# Altium project SensorNode.PrjPcb
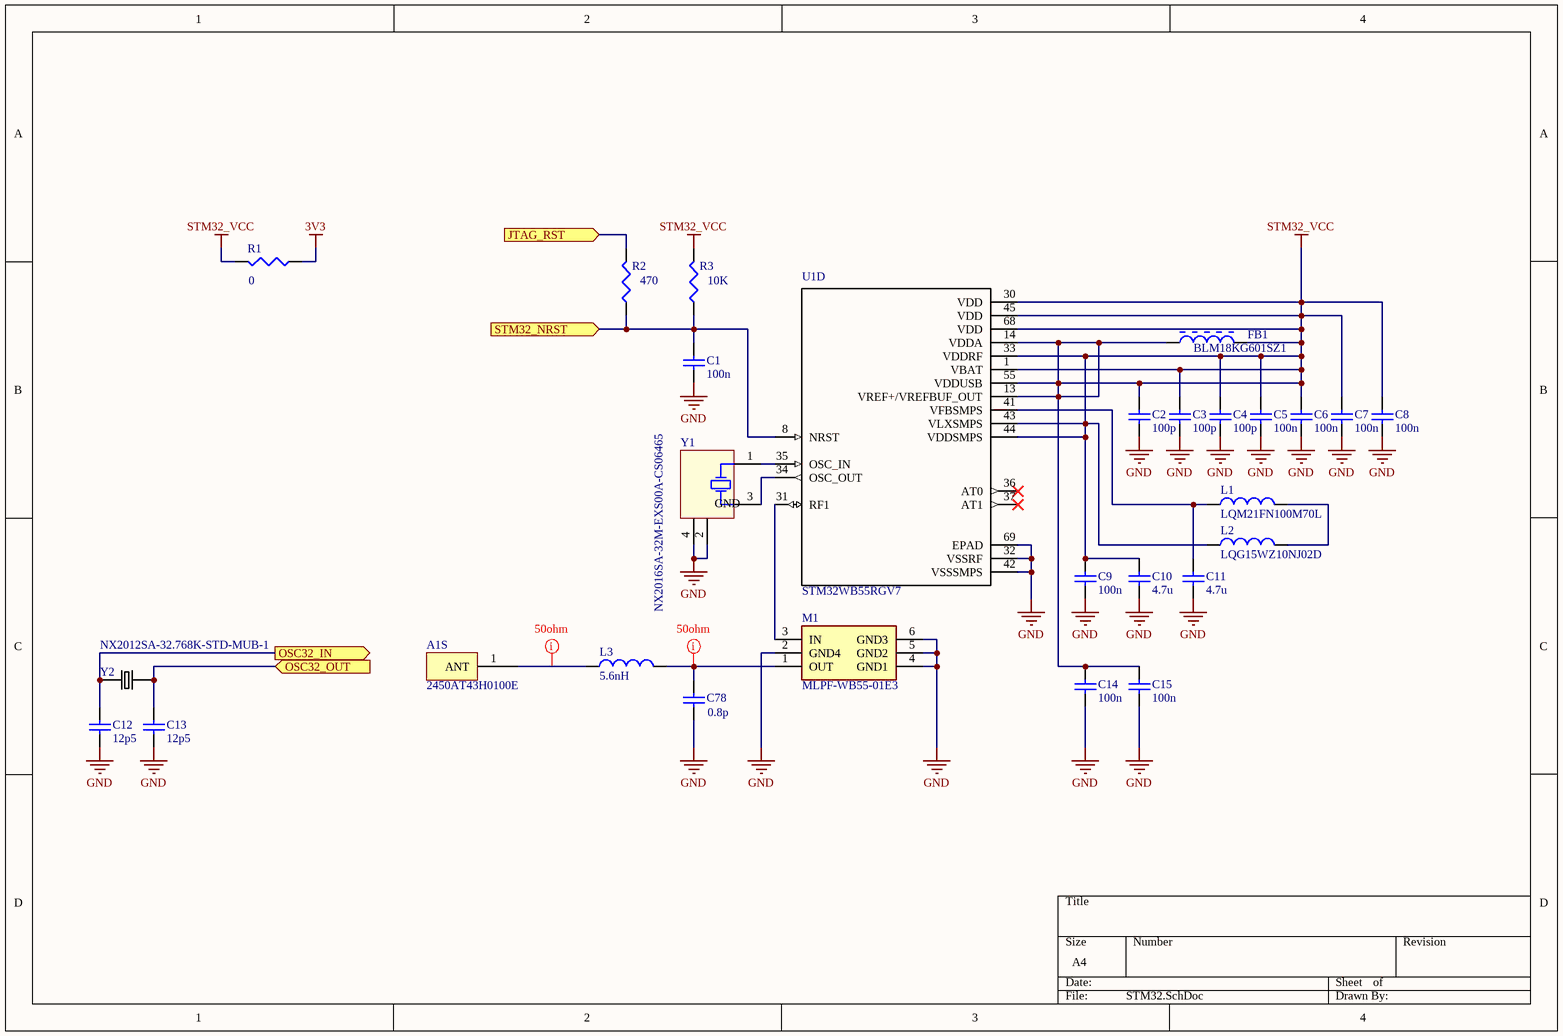
[diagram p0: STM32.SchDoc]
7 sheets, 166 parts. Net scope: flat (ports and power ports of the same name join across sheets).
Board file: PCB1.PcbDoc
Sheets:
  STM32.SchDoc
  STM32_GPIO.SchDoc
  ExtFlash.SchDoc
  TmpLightHumBaro.SchDoc
  MotionMicrophone.SchDoc
  DW1000.SchDoc
  PowerDomains.SchDoc

## Sheet STM32.SchDoc
size A4

### Parts
A1S  2450AT43H0100E  [2450AT43H0100E]
C1  100n  [CAPC1608X90X35NL10T15]
C2  100p  [CAPC1608X90X35NL10T15]
C3  100p  [CAPC1608X90X35NL10T15]
C4  100p  [CAPC1608X90X35NL10T15]
C5  100n  [CAPC1608X90X35NL10T15]
C6  100n  [CAPC1608X90X35NL10T15]
C7  100n  [CAPC1608X90X35NL10T15]
C8  100n  [CAPC1608X90X35NL10T15]
C9  100n  [CAPC1608X90X35NL10T15]
C10  4.7u  [CAPC1608X90X35NL10T15]
C11  4.7u  [CAPC1608X90X35NL10T15]
C12  12p5  [CAPC1608X90X35NL10T15]
C13  12p5  [CAPC1608X90X35NL10T15]
C14  100n  [CAPC1608X90X35NL10T15]
C15  100n  [CAPC1608X90X35NL10T15]
C78  0.8p  [CAPC1005X55X25ML05T10]
FB1  BLM18KG601SZ1  [MURA-BLM18SG-B25-CHIP-2_V1]
L1  LQM21FN100M70L  [MURA-IND0805_L]
L2  LQG15WZ10NJ02D  [0402-A]
L3  5.6nH  [0402-A]
M1  MLPF-WB55-01E3  [MLPFWB5501E3]
R1  value 0  [J1-0603]
R2  value 470  [J1-0603]
R3  value 10K  [J1-0603]
U1  STM32WB55RGV7  [*QFN40P800X800X100-69N]  (part D of 4)
Y1  NX2016SA-32M-EXS00A-CS06465  [NDK-NX2016SA-26MHZ-EXS00A-CS06025-4_V]
Y2  NX2012SA-32.768K-STD-MUB-1  [*XTAL_NX2012SA-32.768K-STD-MUB-1]

### Ports
JTAG_RST (in), OSC32_IN (out), OSC32_OUT (in), STM32_NRST (in)

### Nets
3V3: R1.1
GND: C1.1 C2.1 C3.1 C4.1 C5.1 C6.1 C7.1 C8.1 C9.1 C10.1 C11.1 C12.1 C13.1 C14.1 C15.1 C78.1 M1.2(GND4) M1.4(GND1) M1.5(GND2) M1.6(GND3) U1.32(VSSRF) U1.42(VSSSMPS) U1.69(EPAD) Y1.2(GND) Y1.4(GND)
STM32_VCC: C2.2 C3.2 C4.2 C5.2 C6.2 C7.2 C8.2 C9.2 C10.2 C14.2 C15.2 FB1.1 FB1.2 L2.1 R1.2 R3.2 U1.1(VBAT) U1.13(VREF+/VREFBUF_OUT) U1.14(VDDA) U1.30(VDD) U1.33(VDDRF) U1.43(VLXSMPS) U1.44(VDDSMPS) U1.45(VDD) U1.55(VDDUSB) U1.68(VDD)
NetA1S_1: A1S.1(ANT) L3.1
NetC1_2: C1.2 R2.1 R3.1 U1.8(NRST) ; port STM32_NRST
NetC11_2: C11.2 L1.1 U1.41(VFBSMPS)
NetC12_2: C12.2 Y2.1 ; port OSC32_IN
NetC13_2: C13.2 Y2.2 ; port OSC32_OUT
NetC78_2: C78.2 L3.2 M1.1(OUT)
NetJ2_10: R2.2 ; port JTAG_RST
NetL1_2: L1.2 L2.2
NetM1_3: M1.3(IN) U1.31(RF1)
NetU1_34: U1.34(OSC_OUT) Y1.3(X2)
NetU1_35: U1.35(OSC_IN) Y1.1(X1)

Not connected (* = marked no-connect by the designer): U1 36(AT0)* 37(AT1)*

### Layout directives
rule Width Constraint [Pref Impedance = 50,00ohms    Min Impedance = 50,00ohms    Max Impedance = 50,00ohms]; rule Routing Layers [TopLayer - Enabled BottomLayer - Disabled]; rule Parallel Segment Constraint [Gap = 0.5mm    Limit = 10mm    Layer - Same Layer]: NetA1S_1, NetC78_2

### Library data of the parts
C1 C15 = CMP-2006-02891-1: Part Number: GRM188R71H102KA01D; Manufacturer: Murata
C2-C14 = CMP-2006-02891-1
C78 = CMP-2008-03945-1
FB1 = CMP-0686-00596-2: Chip Ferrite Bead for Power Lines (Low DC Resistance Type), 220 Ohm, 2500 mA, -55 to 125 degC, 1.6 x 0.8 x 0.65 mm SMD, Tape and Reel; Manufacturer: Murata; PartNumber: BLM18SG221TN1D; Impedance (at 100 MHz): 220 Ohm +/- 25%; DC Resistance: 0.040 Ohm Max.; Rated Current: 2500 mA; ComponentLink2Description: Datasheet; ComponentLink1Description: Manufacturer URL; ComponentLink3Description: Package Specification; DatasheetVersion: 08/2013; Packing: Tape and Reel; PackageReference: BLM18_H650-2; PackageDescription: 2-Pin Chip, Body 1.6 x 0.8 mm; Mounting Technology: Surface Mount; Operating Temperature Range: -55 to 125 degC; ComponentLink1URL: http://www.murata.com/; ComponentLink2URL: http://www.murata.com/products/catalog/pdf/c31e.pdf; ComponentLink3URL: http://www.murata.com/products/catalog/pdf/c31e.pdf
L1 = CMP-2000-06587-1: Fixed Inductor, 10 uH, +/-20%, -55 to 125 degC, 2-Pin SMD (0805), RoHS, Tape and Reel; Manufacturer: Murata; Tolerance (%): 20%; DC Resistance: 0.6; Inductance-Nom: 10H; Rated Current-Max: 100mA; Package Reference: IND0805; Case Size/Dimension: 0805; Manufacturer URL: http://www.murata.com/; Package Description: 2-Pin Surface Mount Device, Body 2 x 1.25 mm; Datasheet URL: http://psearch.en.murata.com/inductor/product/LQM21FN100M70%23.pdf; Mounting Technology: SurfaceMount; Datasheet Version: 05/2016
L2 L3 = Inductor: Code_IEC: 1005; Published: 8-Jun-2000; LatestRevisionDate: 29-May-2009; LatestRevisionNote: IPC-7351 Footprint Added.; PackageReference: 0402-A; Publisher: Altium Limited; PackageDescription: Chip Inductor; Code_JEITA: 0402
M1 = MLPF-WB55-01E3: Filter; Manufacturer_Name: STMicroelectronics; Datasheet Link: https://componentsearchengine.com/Datasheets/1/MLPF-WB55-01E3.pdf; Height: 0.7mm; Mouser Part Number: 511-MLPF-WB55-01E3; Mouser Price/Stock: https://www.mouser.com/Search/Refine.aspx?Keyword=511-MLPF-WB55-01E3; Manufacturer_Part_Number: MLPF-WB55-01E3
R1-R3 = Res3: Resistor; Published: 8-Jun-2000; LatestRevisionDate: 29-May-2009; LatestRevisionNote: IPC-7351 Footprint Added.; PackageReference: J1-0603; Publisher: Altium Limited; PackageDescription: Chip Resistor
U1 = STM32WB55RGV7: Multiprotocol wireless 32-bit MCU Arm-based Cortex-M4; MF: STMicroelectronics; MP: STM32WB55RGV7; Price: None; Package: None; Availability: Unavailable; SnapEDA_Link: https://www.snapeda.com/parts/STM32WB55RGV7/STMicroelectronics/view-part/?ref=snap; Value: *
Y1 = CMP-0454-00001-2: Crystal, 26 MHz, 8 pF, for OA / AV / Short-range Wireless, -10 to 75 degC, 2.0 x 1.6 x 0.45 mm SMD; PartNumber: NX2016SA-26MHZ-EXS00A-CS06025; Manufacturer: NDK; Level of drive: 10 uW (Max. 200 uW); Overtone Order: Fundamental; Load Capacitance: 8 pF; Nominal Frequency: 26 MHz; Operating Temperature: -10 to 75 degC; ComponentLink1Description: Manufacturer URL; ComponentLink3Description: Package Specification; ComponentLink3URL: http://www.ndk.com/images/products/catalog/c_NX2016SA-STD-CZS-1_e.pdf; PackageDescription: 4-Pin Hand Drawn, Body 2x1.6mm; Storage temperature range: -40 to 85 degC; ComponentLink1URL: https://www.ndk.com; Mounting Technology: Surface Mount; PackageReference: NX2016SA-26MHZ-EXS00A-CS06025-4; ComponentLink2Description: Datasheet; ComponentLink2URL: http://www.ndk.com/images/products/catalog/c_NX2016SA-STD-CZS-1_e.pdf
Y2 = NX2012SA-32.768K-STD-MUB-1: Crystal 32.7680khz 12.5pf Smd; MF: NDK America,; MP: NX2012SA-32.768K-STD-MUB-1; Price: None; Package: SMD-2 NDK; Availability: Unavailable; SnapEDA_Link: https://www.snapeda.com/parts/NX2012SA-32.768K-STD-MUB-1/NDK%20America%2C%20Inc./view-part/?ref=snap; Value: *

## Sheet STM32_GPIO.SchDoc
size A4
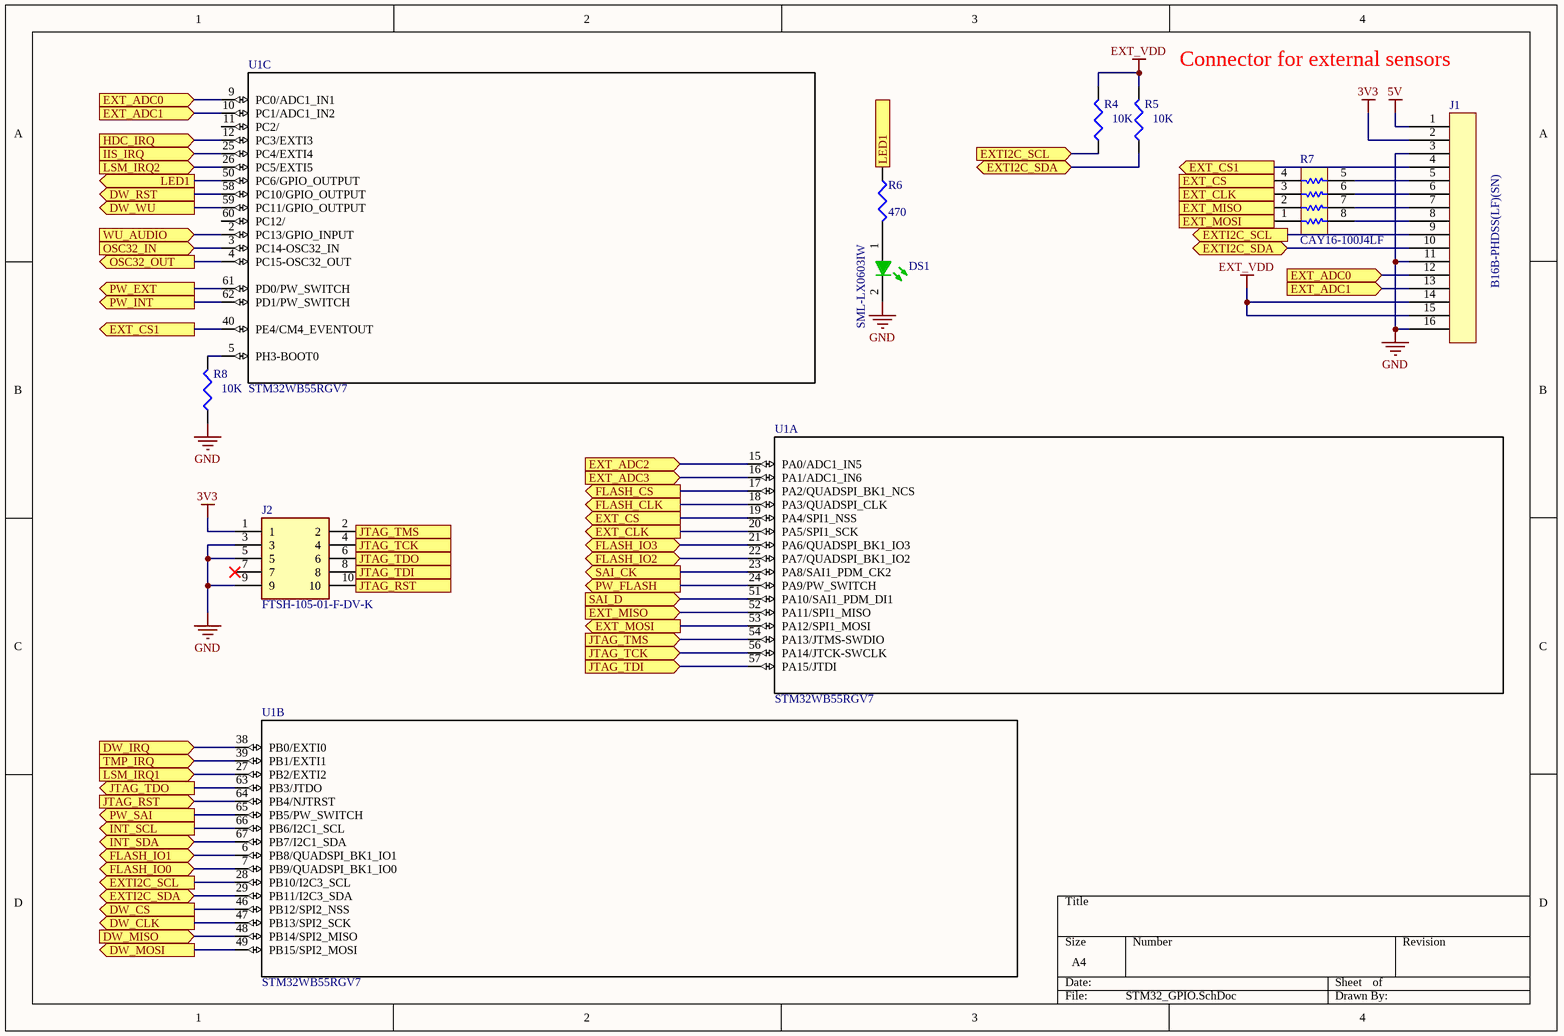
[diagram p1: STM32_GPIO.SchDoc]

### Parts
DS1  SML-LX0603IW  [KING-0603LED_GREEN_V]
J1  B16B-PHDSS(LF)(SN)  [B16B-PHDSS(LF)(SN) - duplicate]
J2  FTSH-105-01-F-DV-K  [SAMTEC_FTSH-105-01-L-DV]
R4  value 10K  [J1-0603]
R5  value 10K  [J1-0603]
R6  value 470  [J1-0603]
R7  CAY16-100J4LF  [BOUR-CAY16-J4_V]
R8  value 10K  [J1-0603]
U1  STM32WB55RGV7  [*QFN40P800X800X100-69N]  (parts A,B,C of 4)

### Ports
DW_CLK (out), DW_CS (out), DW_IRQ (in), DW_MISO (in), DW_MOSI (out), DW_RST (out), DW_WU (out), EXT_ADC0 (in), EXT_ADC1 (in), EXT_ADC2 (in), EXT_ADC3 (in), EXT_CLK (out), EXT_CS1 (out), EXT_CS (out), EXT_MISO (in), EXT_MOSI (out), EXTI2C_SCL (in), EXTI2C_SCL (out), EXTI2C_SDA (bidir), FLASH_CLK (out), FLASH_CS (out), FLASH_IO0 (bidir), FLASH_IO1 (bidir), FLASH_IO2 (bidir), FLASH_IO3 (bidir), HDC_IRQ (in), IIS_IRQ (in), INT_SCL (out), INT_SDA (bidir), JTAG_RST (in), JTAG_RST (out), JTAG_TCK (in), JTAG_TCK (out), JTAG_TDI (in), JTAG_TDI (out), JTAG_TDO (in), JTAG_TDO (out), JTAG_TMS (in), JTAG_TMS (out), LED1 (in), LED1 (out), LSM_IRQ1 (in), LSM_IRQ2 (in), OSC32_IN (in), OSC32_OUT (out), PW_EXT (out), PW_FLASH (out), PW_INT (out), PW_SAI (out), SAI_CK (out), SAI_D (in), TMP_IRQ (in), WU_AUDIO (in)

### Nets
3V3: J1.2 J2.1
5V: J1.1
EXT_VDD: J1.14 J1.15 R4.2 R5.2
GND: DS1.2(K) J1.3 J1.11 J1.16 J2.3 J2.5 J2.9 R8.1
NetC12_2: U1.3(PC14-OSC32_IN) ; port OSC32_IN
NetC13_2: U1.4(PC15-OSC32_OUT) ; port OSC32_OUT
NetDS1_1: DS1.1(A) R6.2
NetJ1_4: J1.4 U1.40(PE4/CM4_EVENTOUT) ; port EXT_CS1
NetJ1_5: J1.5 R7.5
NetJ1_6: J1.6 R7.6
NetJ1_7: J1.7 R7.7
NetJ1_8: J1.8 R7.8
NetJ1_9: J1.9 R4.1 U1.28(PB10/I2C3_SCL) ; port EXTI2C_SCL
NetJ1_10: J1.10 R5.1 U1.29(PB11/I2C3_SDA) ; port EXTI2C_SDA
NetJ1_12: J1.12 U1.9(PC0/ADC1_IN1) ; port EXT_ADC0
NetJ1_13: J1.13 U1.10(PC1/ADC1_IN2) ; port EXT_ADC1
NetJ2_2: J2.2 U1.54(PA13/JTMS-SWDIO) ; port JTAG_TMS
NetJ2_4: J2.4 U1.56(PA14/JTCK-SWCLK) ; port JTAG_TCK
NetJ2_6: J2.6 U1.63(PB3/JTDO) ; port JTAG_TDO
NetJ2_8: J2.8 U1.57(PA15/JTDI) ; port JTAG_TDI
NetJ2_10: J2.10 U1.64(PB4/NJTRST) ; port JTAG_RST
NetJ3_12: U1.15(PA0/ADC1_IN5) ; port EXT_ADC2
NetJ3_13: U1.16(PA1/ADC1_IN6) ; port EXT_ADC3
NetR6_1: R6.1 U1.50(PC6/GPIO_OUTPUT) ; port LED1
NetR7_1: R7.1 U1.53(PA12/SPI1_MOSI) ; port EXT_MOSI
NetR7_2: R7.2 U1.52(PA11/SPI1_MISO) ; port EXT_MISO
NetR7_3: R7.3 U1.20(PA5/SPI1_SCK) ; port EXT_CLK
NetR7_4: R7.4 U1.19(PA4/SPI1_NSS) ; port EXT_CS
NetR8_2: R8.2 U1.5(PH3-BOOT0)
NetR11_5: U1.46(PB12/SPI2_NSS) ; port DW_CS
NetR11_6: U1.49(PB15/SPI2_MOSI) ; port DW_MOSI
NetR11_7: U1.48(PB14/SPI2_MISO) ; port DW_MISO
NetR11_8: U1.47(PB13/SPI2_SCK) ; port DW_CLK
NetR16_2: U1.38(PB0/EXTI0) ; port DW_IRQ
NetR30_1: U1.17(PA2/QUADSPI_BK1_NCS) ; port FLASH_CS
NetR30_2: U1.6(PB8/QUADSPI_BK1_IO1) ; port FLASH_IO1
NetR30_3: U1.22(PA7/QUADSPI_BK1_IO2) ; port FLASH_IO2
NetR31_5: U1.7(PB9/QUADSPI_BK1_IO0) ; port FLASH_IO0
NetR31_6: U1.18(PA3/QUADSPI_CLK) ; port FLASH_CLK
NetR31_7: U1.21(PA6/QUADSPI_BK1_IO3) ; port FLASH_IO3
NetR38_2: U1.2(PC13/GPIO_INPUT) ; port WU_AUDIO
NetR42_1: U1.39(PB1/EXTI1) ; port TMP_IRQ
NetR43_2: U1.12(PC3/EXTI3) ; port HDC_IRQ
NetR44_2: U1.25(PC4/EXTI4) ; port IIS_IRQ
NetR45_2: U1.26(PC5/EXTI5) ; port LSM_IRQ2
NetR46_1: U1.67(PB7/I2C1_SDA) ; port INT_SDA
NetR47_1: U1.66(PB6/I2C1_SCL) ; port INT_SCL
NetR48_2: U1.27(PB2/EXTI2) ; port LSM_IRQ1
NetS2_2: U1.51(PA10/SAI1_PDM_DI1) ; port SAI_D
NetS2_3: U1.23(PA8/SAI1_PDM_CK2) ; port SAI_CK
NetU1_24: U1.24(PA9/PW_SWITCH) ; port PW_FLASH
NetU1_58: U1.58(PC10/GPIO_OUTPUT) ; port DW_RST
NetU1_59: U1.59(PC11/GPIO_OUTPUT) ; port DW_WU
NetU1_61: U1.61(PD0/PW_SWITCH) ; port PW_EXT
NetU1_62: U1.62(PD1/PW_SWITCH) ; port PW_INT
NetU1_65: U1.65(PB5/PW_SWITCH) ; port PW_SAI

Not connected (* = marked no-connect by the designer): J2 7*; U1 11(PC2/) 60(PC12/)

### Notes on the sheet
- Connector for external sensors

### Library data of the parts
DS1 = CMP-0404-00001-1: LED, SMT, 0603(1608), 1.1mm thickness, Green; Manufacturer: Kingbright; PartNumber: KP-1608MGC; Reverse Voltage: 5 V; Power Dissipation: 75 mW; Forward Current: 30 mA; Packing Type: 2000 pcs / reel; Mounting Technology: Surface Mount; Storage Temperature: -40 to +85 degC; ComponentLink1URL: http://www.kingbright.com/; PackageDescription: 2-Pin SMT LED, 1.6 x 0.8 mm Pitch; PackageReference: 0603LED_GREEN; ComponentLink1Description: Manufacturer URL
J1 = B16B-PHDSS(LF)(SN): CONN HEADER VERT 16POS 2MM; ComponentLink1Description: Digikey; ComponentLink1URL: https://www.digikey.com/products/en?keywords=B16B-PHDSS(LF)(SN)
J2 = FTSH-105-01-F-DV-K: Connector; Manufacturer_Name: SAMTEC; Datasheet Link: http://suddendocs.samtec.com/prints/ftsh-1xx-xx-xxx-dv-xxx-xxx-mkt.pdf; Manufacturer_Part_Number: FTSH-105-01-F-DV-K; Mouser Part Number: 200-FTSH10501FDVK; Mouser Price/Stock: https://www.mouser.com/Search/Refine.aspx?Keyword=200-FTSH10501FDVK; RS Part Number: 1592372; RS Price/Stock: http://uk.rs-online.com/web/p/products/1592372
R4-R6 R8 = Res3: Resistor; Published: 8-Jun-2000; LatestRevisionDate: 29-May-2009; LatestRevisionNote: IPC-7351 Footprint Added.; PackageReference: J1-0603; Publisher: Altium Limited; PackageDescription: Chip Resistor
R7 = CMP-1747-00007-1: Chip Resistor Array, 1 KOhm, +/- 5%, 62.5 mW, -55 to 125 degC, 8-Pin SMD, RoHS, Tape and Reel; Power Rating: 100 mW; Tolerance: 1%; Voltage Rating (DC): 50 V; Resistance: 330 Ohm; Case\Package: 0603; RoHSCompliant: true; Case Code (Metric): 1608; Pins: 2; PackageDescription: 8-Pin Surface Mount Device, Body 1.6 x 3.2 mm, Pitch 0.8 mm; Height: 0.45 mm; Min Operating Temperature: -55 degC; ComponentLink1URL: http://www.bourns.com/; Case Code (Imperial): 0603; Packaging: Tape and Reel; PackageReference: CAY16-J4; ComponentLink1Description: Manufacturer URL; ComponentLink2Description: Datasheet; Length: 1.6 mm; Width: 0.8 mm; Max Operating Temperature: 155 degC; Mount: Surface Mount; DatasheetVersion: Sep-14; Voltage Rating: 50 V; REACH SVHC: No SVHC; ComponentLink2URL: http://www.bourns.com/pdfs/CATCAY.pdf; Package Quantity: 5000
U1 = STM32WB55RGV7: as U1 on sheet STM32; MP: STM32WB55RGV7; Price: None; Package: None; Availability: Unavailable; SnapEDA_Link: https://www.snapeda.com/parts/STM32WB55RGV7/STMicroelectronics/view-part/?ref=snap; Value: *

## Sheet ExtFlash.SchDoc
size A4
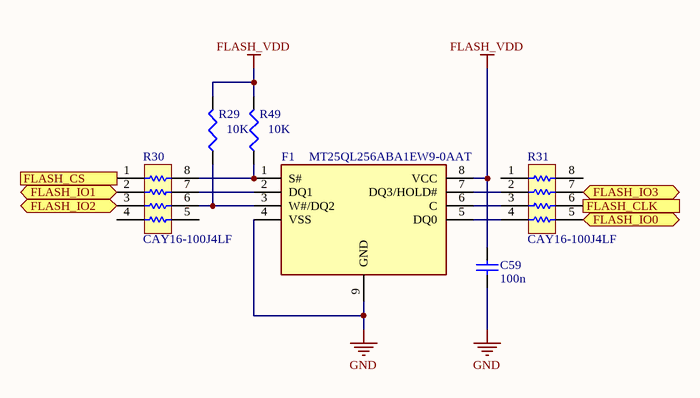
[diagram p2: ExtFlash.SchDoc]

### Parts
C59  100n  [CAPC1608X90X35NL10T15]
F1  MT25QL256ABA1EW9-0AAT  [SON127P800X600X80-9N-D]
R29  value 10K  [J1-0603]
R30  CAY16-100J4LF  [BOUR-CAY16-J4_V]
R31  CAY16-100J4LF  [BOUR-CAY16-J4_V]
R49  value 10K  [J1-0603]

### Ports
FLASH_CLK (in), FLASH_CS (in), FLASH_IO0 (bidir), FLASH_IO1 (bidir), FLASH_IO2 (bidir), FLASH_IO3 (bidir)

### Nets
FLASH_VDD: C59.2 F1.8(VCC) R29.2 R49.2
GND: C59.1 F1.4(VSS) F1.9(GND)
NetF1_1: F1.1(S#) R30.8 R49.1
NetF1_2: F1.2(DQ1) R30.7
NetF1_3: F1.3(W#/DQ2) R29.1 R30.6
NetF1_5: F1.5(DQ0) R31.4
NetF1_6: F1.6(C) R31.3
NetF1_7: F1.7(DQ3/HOLD#) R31.2
NetR30_1: R30.1 ; port FLASH_CS
NetR30_2: R30.2 ; port FLASH_IO1
NetR30_3: R30.3 ; port FLASH_IO2
NetR31_5: R31.5 ; port FLASH_IO0
NetR31_6: R31.6 ; port FLASH_CLK
NetR31_7: R31.7 ; port FLASH_IO3

Not connected (* = marked no-connect by the designer): R30 4 5; R31 1 8

### Library data of the parts
C59 = CMP-2006-02891-1: as C1 on sheet STM32
F1 = MT25QL256ABA1EW9-0AAT: Integrated Circuit; Manufacturer_Name: Micron; Datasheet Link: https://www.micron.com/~/media/documents/products/data-sheet/nor-flash/serial-nor/mt25q/die-rev-a/mt25q_qljs_l_256_aba_0.pdf; Height: 0.8mm; Manufacturer_Part_Number: MT25QL256ABA1EW9-0AAT; Mouser Part Number: 340-322381-TRAY; Mouser Price/Stock: https://www.mouser.com/Search/Refine.aspx?Keyword=340-322381-TRAY
R29 R49 = Res3: Resistor; Published: 8-Jun-2000; LatestRevisionDate: 29-May-2009; LatestRevisionNote: IPC-7351 Footprint Added.; PackageReference: J1-0603; Publisher: Altium Limited; PackageDescription: Chip Resistor
R30 R31 = CMP-1747-00007-1: as R7 on sheet STM32_GPIO; RoHSCompliant: true; Case Code (Metric): 1608; Pins: 2; PackageDescription: 8-Pin Surface Mount Device, Body 1.6 x 3.2 mm, Pitch 0.8 mm; Height: 0.45 mm; Min Operating Temperature: -55 degC; ComponentLink1URL: http://www.bourns.com/; Case Code (Imperial): 0603; Packaging: Tape and Reel; PackageReference: CAY16-J4; ComponentLink1Description: Manufacturer URL; ComponentLink2Description: Datasheet; Length: 1.6 mm; Width: 0.8 mm; Max Operating Temperature: 155 degC; Mount: Surface Mount; DatasheetVersion: Sep-14; Voltage Rating: 50 V; REACH SVHC: No SVHC; ComponentLink2URL: http://www.bourns.com/pdfs/CATCAY.pdf; Package Quantity: 5000

## Sheet TmpLightHumBaro.SchDoc
size A4
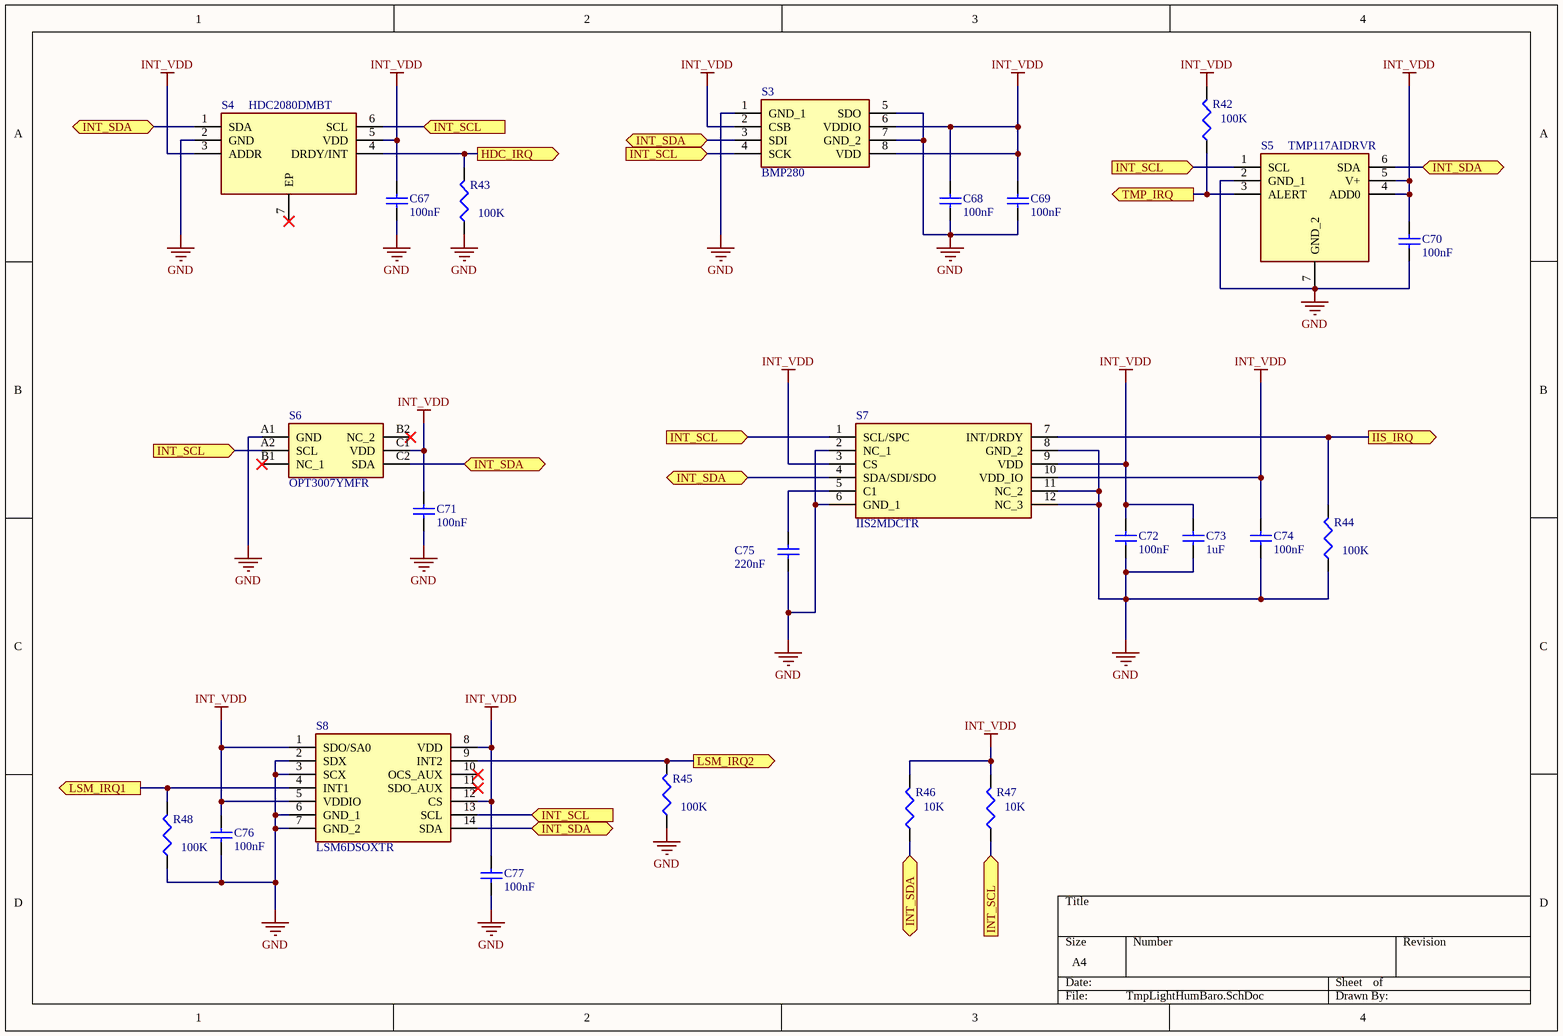
[diagram p3: TmpLightHumBaro.SchDoc]

### Parts
C67  100nF  [CAPC1608X90X35NL10T15]
C68  100nF  [CAPC1608X90X35NL10T15]
C69  100nF  [CAPC1608X90X35NL10T15]
C70  100nF  [CAPC1608X90X35NL10T15]
C71  100nF  [CAPC1608X90X35NL10T15]
C72  100nF  [CAPC1608X90X35NL10T15]
C73  1uF  [CAPC1608X90X35NL10T15]
C74  100nF  [CAPC1608X90X35NL10T15]
C75  220nF  [CAPC1608X90X35NL10T15]
C76  100nF  [CAPC1608X90X35NL10T15]
C77  100nF  [CAPC1608X90X35NL10T15]
R42  value 100K  [J1-0603]
R43  value 100K  [J1-0603]
R44  value 100K  [J1-0603]
R45  value 100K  [J1-0603]
R46  value 10K  [J1-0603]
R47  value 10K  [J1-0603]
R48  value 100K  [J1-0603]
S3  BMP280  [8-PIN-METAL-LID-LGA_1]
S4  HDC2080DMBT  [SON100P300X300X80-7N-D]
S5  TMP117AIDRVR  [SON65P200X200X80-7N]
S6  OPT3007YMFR  [BGA6C35P2X3_86X95X23]
S7  IIS2MDCTR  [IIS2MDCTR]
S8  LSM6DSOXTR  [LGA-14_1]

### Ports
HDC_IRQ (out), IIS_IRQ (out), INT_SCL (in), INT_SDA (bidir), LSM_IRQ1 (out), LSM_IRQ2 (out), TMP_IRQ (out)

### Nets
GND: C67.2 C68.2 C69.2 C70.2 C71.2 C72.2 C73.2 C74.2 C75.2 C76.2 C77.2 R43.1 R44.1 R45.1 R48.1 S3.1(GND_1) S3.5(SDO) S3.7(GND_2) S4.2(GND) S5.2(GND_1) S5.7(GND_2) S6.A1(GND) S7.2(NC_1) S7.6(GND_1) S7.8(GND_2) S7.11(NC_2) S7.12(NC_3) S8.2(SDX) S8.3(SCX) S8.6(GND_1) S8.7(GND_2)
INT_VDD: C67.1 C68.1 C69.1 C70.1 C71.1 C72.1 C73.1 C74.1 C76.1 C77.1 R42.2 R46.2 R47.2 S3.2(CSB) S3.6(VDDIO) S3.8(VDD) S4.3(ADDR) S4.5(VDD) S5.4(ADD0) S5.5(V+) S6.C1(VDD) S7.3(CS) S7.9(VDD) S7.10(VDD_IO) S8.1(SDO/SA0) S8.5(VDDIO) S8.8(VDD) S8.12(CS)
NetC75_1: C75.1 S7.5(C1)
NetR42_1: R42.1 S5.3(ALERT) ; port TMP_IRQ
NetR43_2: R43.2 S4.4(DRDY/INT) ; port HDC_IRQ
NetR44_2: R44.2 S7.7(INT/DRDY) ; port IIS_IRQ
NetR45_2: R45.2 S8.9(INT2) ; port LSM_IRQ2
NetR46_1: R46.1 S3.3(SDI) S4.1(SDA) S5.6(SDA) S6.C2(SDA) S7.4(SDA/SDI/SDO) S8.14(SDA) ; port INT_SDA
NetR47_1: R47.1 S3.4(SCK) S4.6(SCL) S5.1(SCL) S6.A2(SCL) S7.1(SCL/SPC) S8.13(SCL) ; port INT_SCL
NetR48_2: R48.2 S8.4(INT1) ; port LSM_IRQ1

Not connected (* = marked no-connect by the designer): S4 7(EP)*; S6 B1(NC_1)* B2(NC_2)*; S8 10(OCS_AUX)* 11(SDO_AUX)*

### Library data of the parts
C67-C77 = CMP-2006-02891-1: as C1 on sheet STM32
R42-R48 = Res3: Resistor; Published: 8-Jun-2000; LatestRevisionDate: 29-May-2009; LatestRevisionNote: IPC-7351 Footprint Added.; PackageReference: J1-0603; Publisher: Altium Limited; PackageDescription: Chip Resistor
S3 = BMP280: Integrated Circuit; Manufacturer_Name: Bosch; Datasheet Link: https://ae-bst.resource.bosch.com/media/_tech/media/datasheets/BST-BMP280-DS001-19.pdf; Manufacturer_Part_Number: BMP280; Mouser Part Number: 262-BMP280
S4 = HDC2080DMBT: Undefined or Miscellaneous; Manufacturer_Name: Texas Instruments; Datasheet Link: http://www.ti.com/lit/gpn/hdc2080; Height: 0.8mm; Manufacturer_Part_Number: HDC2080DMBT; Mouser Part Number: 595-HDC2080DMBT; Mouser Price/Stock: https://www.mouser.com/Search/Refine.aspx?Keyword=595-HDC2080DMBT; RS Part Number: 1797065P; RS Price/Stock: http://uk.rs-online.com/web/p/products/1797065P
S5 = TMP117AIDRVR: Integrated Circuit; Manufacturer_Name: Texas Instruments; Datasheet Link: http://www.ti.com/lit/gpn/tmp117; Height: 0.8mm; Manufacturer_Part_Number: TMP117AIDRVR; Mouser Part Number: 595-TMP117AIDRVR; Mouser Price/Stock: https://www.mouser.com/Search/Refine.aspx?Keyword=595-TMP117AIDRVR
S6 = OPT3007YMFR: Integrated Circuit; Manufacturer_Name: Texas Instruments; Datasheet Link: http://www.ti.com/lit/gpn/opt3007; Height: 0.226mm; Manufacturer_Part_Number: OPT3007YMFR; Mouser Part Number: 595-OPT3007YMFR; Mouser Price/Stock: https://www.mouser.com/Search/Refine.aspx?Keyword=595-OPT3007YMFR
S7 = IIS2MDCTR: Integrated Circuit; Manufacturer_Name: STMicroelectronics; Datasheet Link: https://www.st.com/resource/en/datasheet/iis2mdc.pdf; Height: 0.7mm; Manufacturer_Part_Number: IIS2MDCTR; Mouser Part Number: 511-IIS2MDCTR; Mouser Price/Stock: https://www.mouser.com/Search/Refine.aspx?Keyword=511-IIS2MDCTR
S8 = LSM6DSOXTR: Accelerometer; Manufacturer_Name: STMicroelectronics; Datasheet Link: https://www.st.com/resource/en/datasheet/lsm6dsox.pdf; Manufacturer_Part_Number: LSM6DSOXTR; Mouser Part Number: 511-LSM6DSOXTR; Mouser Price/Stock: https://www.mouser.com/Search/Refine.aspx?Keyword=511-LSM6DSOXTR

## Sheet MotionMicrophone.SchDoc
size A4
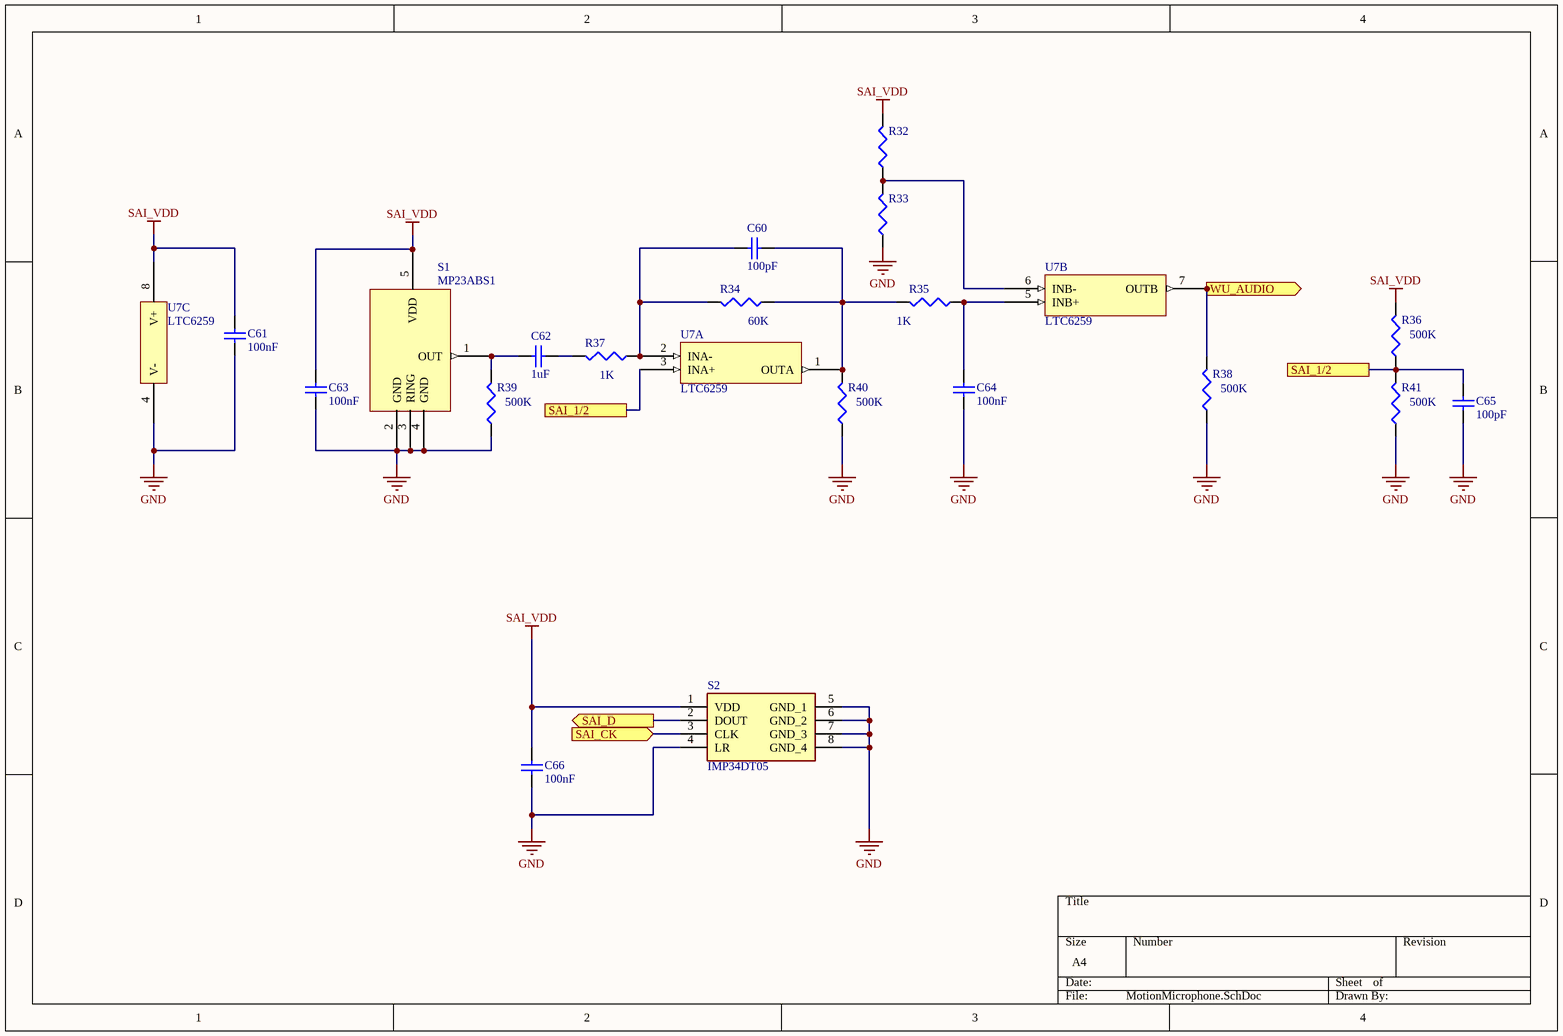
[diagram p4: MotionMicrophone.SchDoc]

### Parts
C60  100pF  [CAPC1608X90X35NL10T15]
C61  100nF  [CAPC1608X90X35NL10T15]
C62  1uF  [CAPC1608X90X35NL10T15]
C63  100nF  [CAPC1608X90X35NL10T15]
C64  100nF  [CAPC1608X90X35NL10T15]
C65  100pF  [CAPC1608X90X35NL10T15]
C66  100nF  [CAPC1608X90X35NL10T15]
R32  (no value)  [J1-0603]
R33  (no value)  [J1-0603]
R34  value 60K  [J1-0603]
R35  value 1K  [J1-0603]
R36  value 500K  [J1-0603]
R37  value 1K  [J1-0603]
R38  value 500K  [J1-0603]
R39  value 500K  [J1-0603]
R40  value 500K  [J1-0603]
R41  value 500K  [J1-0603]
S1  MP23ABS1  [MP23ABS1]
S2  IMP34DT05  [IMP34DT05]
U7  LTC6259  [SOT23-8]  (parts A,B,C of 3)

### Ports
SAI_1/2, SAI_CK (in), SAI_D (out), WU_AUDIO (out)

### Nets
GND: C61.1 C63.1 C64.1 C65.2 C66.1 R33.1 R38.1 R39.1 R40.1 R41.1 S1.2(GND) S1.3(RING) S1.4(GND) S2.4(LR) S2.5(GND_1) S2.6(GND_2) S2.7(GND_3) S2.8(GND_4) U7.4(V-)
SAI_VDD: C61.2 C63.2 C66.2 R32.2 R36.2 S1.5(VDD) S2.1(VDD) U7.8(V+)
NetC60_1: C60.1 R34.1 R35.2 R40.2 U7.1(OUTA)
NetC60_2: C60.2 R34.2 R37.1 U7.2(INA-)
NetC62_1: C62.1 R37.2
NetC62_2: C62.2 R39.2 S1.1(OUT)
NetC64_2: C64.2 R35.1 U7.5(INB+)
NetC65_1: C65.1 R36.1 R41.2 U7.3(INA+) ; port SAI_1/2
NetR32_1: R32.1 R33.2 U7.6(INB-)
NetR38_2: R38.2 U7.7(OUTB) ; port WU_AUDIO
NetS2_2: S2.2(DOUT) ; port SAI_D
NetS2_3: S2.3(CLK) ; port SAI_CK

### Library data of the parts
C60-C66 = CMP-2006-02891-1: as C1 on sheet STM32
R32-R41 = Res3: Resistor; Published: 8-Jun-2000; LatestRevisionDate: 29-May-2009; LatestRevisionNote: IPC-7351 Footprint Added.; PackageReference: J1-0603; Publisher: Altium Limited; PackageDescription: Chip Resistor
S2 = IMP34DT05: Integrated Circuit; Manufacturer_Name: STMicroelectronics; Datasheet Link: https://www.st.com/resource/en/datasheet/imp34dt05.pdf; Height: 1.1mm; Manufacturer_Part_Number: IMP34DT05; Mouser Part Number: N/A; Mouser Price/Stock: https://www.mouser.com/Search/Refine.aspx?Keyword=N%2FA

## Sheet DW1000.SchDoc
size A4
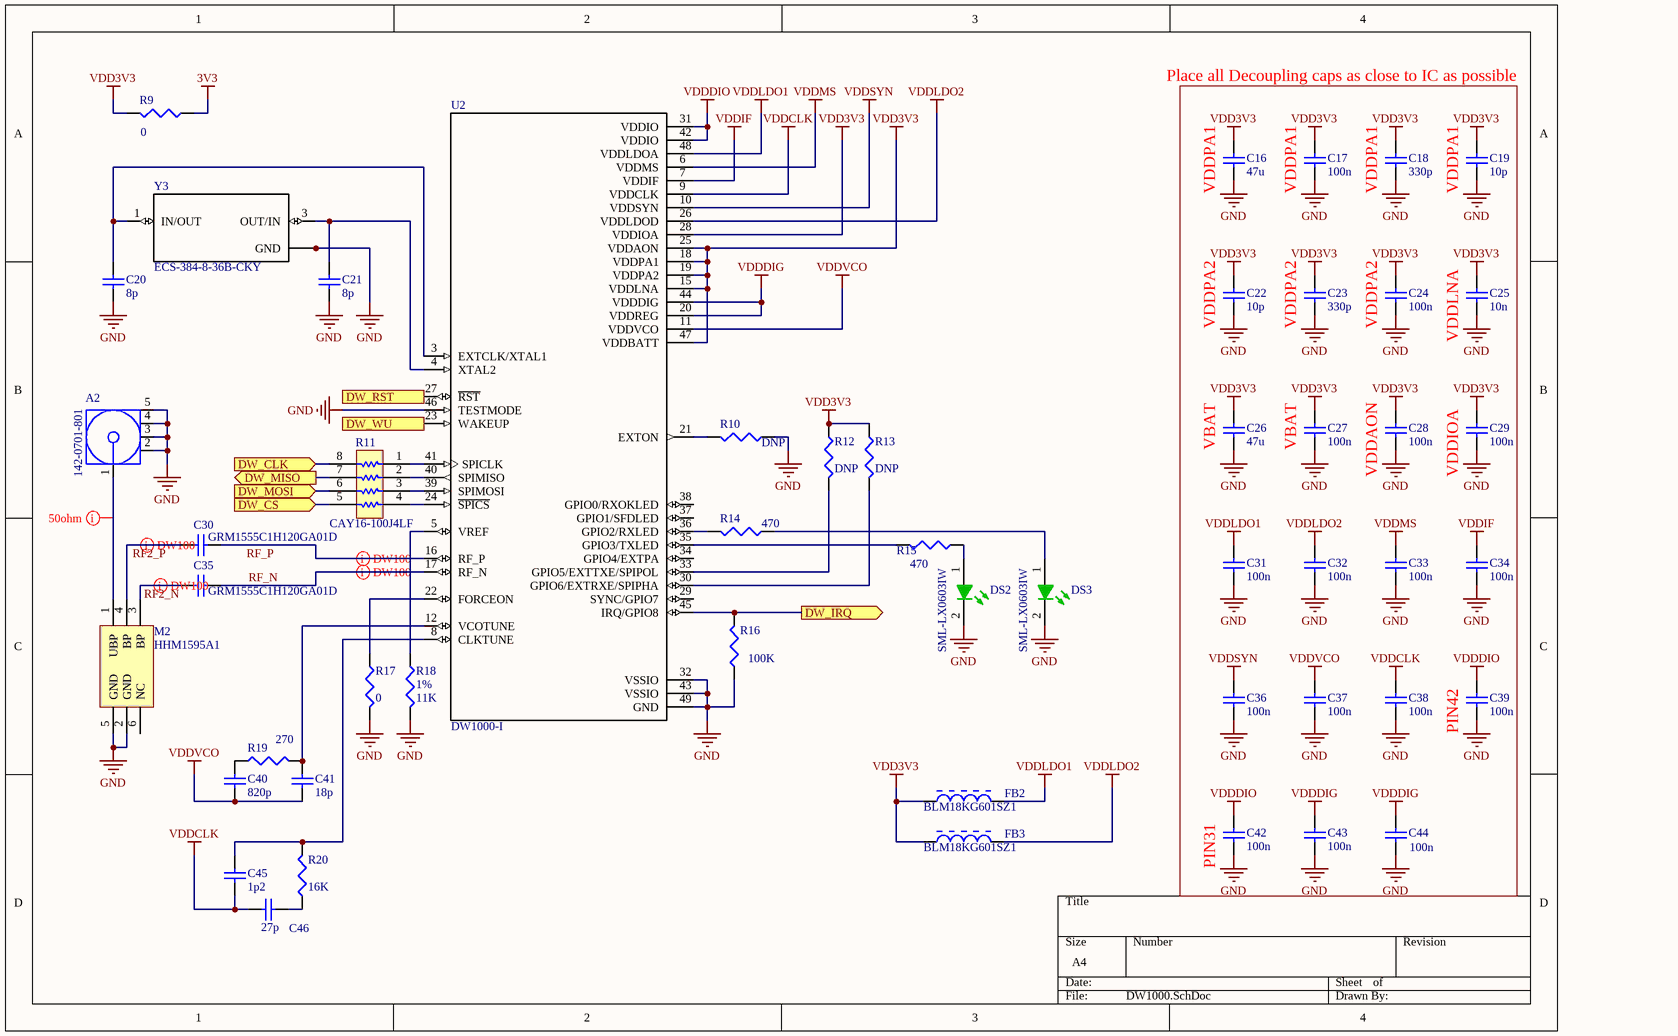
[diagram p5: DW1000.SchDoc]

### Parts
A2  142-0701-801  [CINC-142-0701-801_V]
C16  47u  [CAPC1608X90X35NL10T15]
C17  100n  [CAPC1608X90X35NL10T15]
C18  330p  [CAPC1608X90X35NL10T15]
C19  10p  [CAPC1608X90X35NL10T15]
C20  8p  [CAPC1608X90X35NL10T15]
C21  8p  [CAPC1608X90X35NL10T15]
C22  10p  [CAPC1608X90X35NL10T15]
C23  330p  [CAPC1608X90X35NL10T15]
C24  100n  [CAPC1608X90X35NL10T15]
C25  10n  [CAPC1608X90X35NL10T15]
C26  47u  [CAPC1608X90X35NL10T15]
C27  100n  [CAPC1608X90X35NL10T15]
C28  100n  [CAPC1608X90X35NL10T15]
C29  100n  [CAPC1608X90X35NL10T15]
C30  GRM1555C1H120GA01D  [CAPC1005X55X25ML05T10]
C31  100n  [CAPC1608X90X35NL10T15]
C32  100n  [CAPC1608X90X35NL10T15]
C33  100n  [CAPC1608X90X35NL10T15]
C34  100n  [CAPC1608X90X35NL10T15]
C35  GRM1555C1H120GA01D  [CAPC1005X55X25ML05T10]
C36  100n  [CAPC1608X90X35NL10T15]
C37  100n  [CAPC1608X90X35NL10T15]
C38  100n  [CAPC1608X90X35NL10T15]
C39  100n  [CAPC1608X90X35NL10T15]
C40  820p  [CAPC1608X90X35NL10T15]
C41  18p  [CAPC1608X90X35NL10T15]
C42  100n  [CAPC1608X90X35NL10T15]
C43  100n  [CAPC1608X90X35NL10T15]
C44  100n  [CAPC1608X90X35NL10T15]
C45  1p2  [CAPC1608X90X35NL10T15]
C46  27p  [CAPC1608X90X35NL10T15]
DS2  SML-LX0603IW  [KING-0603LED_GREEN_V]
DS3  SML-LX0603IW  [KING-0603LED_GREEN_V]
FB2  BLM18KG601SZ1  [MURA-BLM18SG-B25-CHIP-2_V1]
FB3  BLM18KG601SZ1  [MURA-BLM18SG-B25-CHIP-2_V1]
M2  HHM1595A1  [TDK-HHM1595A1_V]
R9  value 0  [J1-0603]
R10  value DNP  [J1-0603]
R11  CAY16-100J4LF  [BOUR-CAY16-J4_V]
R12  value DNP  [J1-0603]
R13  value DNP  [J1-0603]
R14  value 470  [J1-0603]
R15  value 470  [J1-0603]
R16  value 100K  [J1-0603]
R17  value 0  [J1-0603]
R18  1%  value 11K  [J1-0603]
R19  value 270  [J1-0603]
R20  value 16K  [J1-0603]
U2  DW1000-I  [*QFN40P600X600X90-49N]
Y3  ECS-384-8-36B-CKY  [*XTAL_ECS-240-8-36-CKM-TR]

### Ports
DW_CLK (in), DW_CS (in), DW_IRQ (out), DW_MISO (out), DW_MOSI (in), DW_RST (in), DW_WU (in)

### Nets
3V3: R9.1
GND: A2.2 A2.3 A2.4 A2.5 C16.1 C17.1 C18.1 C19.1 C20.1 C21.1 C22.1 C23.1 C24.1 C25.1 C26.1 C27.1 C28.1 C29.1 C31.1 C32.1 C33.1 C34.1 C36.1 C37.1 C38.1 C39.1 C42.1 C43.1 C44.1 DS2.2(K) DS3.2(K) M2.2(GND) M2.5(GND) R10.1 R16.1 R17.2 R18.2 U2.32(VSSIO) U2.43(VSSIO) U2.46(TESTMODE) U2.49(GND) Y3.2(GND) Y3.4(GND)
VDD3V3: C16.2 C17.2 C18.2 C19.2 C22.2 C23.2 C24.2 C25.2 C26.2 C27.2 C28.2 C29.2 FB2.1 FB3.1 R9.2 R12.1 R13.1 U2.15(VDDLNA) U2.18(VDDPA1) U2.19(VDDPA2) U2.25(VDDAON) U2.28(VDDIOA) U2.47(VDDBATT)
VDDCLK: C38.2 C45.1 C46.2 U2.9(VDDCLK)
VDDDIG: C43.2 C44.2 U2.20(VDDREG) U2.44(VDDDIG)
VDDDIO: C39.2 C42.2 U2.31(VDDIO) U2.42(VDDIO)
VDDIF: C34.2 U2.7(VDDIF)
VDDLDO1: C31.2 FB2.2 U2.48(VDDLDOA)
VDDLDO2: C32.2 FB3.2 U2.26(VDDLDOD)
VDDMS: C33.2 U2.6(VDDMS)
VDDSYN: C36.2 U2.10(VDDSYN)
VDDVCO: C37.2 C40.1 C41.1 U2.11(VDDVCO)
RF2_N: C35.1 M2.3(BP)
RF2_P: C30.1 M2.4(BP)
RF_N: C35.2 U2.17(RF_N)
RF_P: C30.2 U2.16(RF_P)
NetA2_1: A2.1 M2.1(UBP)
NetC20_2: C20.2 U2.3(EXTCLK/XTAL1) Y3.1(IN/OUT)
NetC21_2: C21.2 U2.4(XTAL2) Y3.3(OUT/IN)
NetC40_2: C40.2 R19.1
NetC41_2: C41.2 R19.2 U2.12(VCOTUNE)
NetC45_2: C45.2 R20.2 U2.8(CLKTUNE)
NetC46_1: C46.1 R20.1
NetDS2_1: DS2.1(A) R15.1
NetDS3_1: DS3.1(A) R14.1
NetR10_2: R10.2 U2.21(EXTON)
NetR11_1: R11.1 U2.41(SPICLK)
NetR11_2: R11.2 U2.40(SPIMISO)
NetR11_3: R11.3 U2.39(SPIMOSI)
NetR11_4: R11.4 U2.24(~{SPICS})
NetR11_5: R11.5 ; port DW_CS
NetR11_6: R11.6 ; port DW_MOSI
NetR11_7: R11.7 ; port DW_MISO
NetR11_8: R11.8 ; port DW_CLK
NetR12_2: R12.2 U2.33(GPIO5/EXTTXE/SPIPOL)
NetR13_2: R13.2 U2.30(GPIO6/EXTRXE/SPIPHA)
NetR14_2: R14.2 U2.36(GPIO2/RXLED)
NetR15_2: R15.2 U2.35(GPIO3/TXLED)
NetR16_2: R16.2 U2.45(IRQ/GPIO8) ; port DW_IRQ
NetR17_1: R17.1 U2.22(FORCEON)
NetR18_1: R18.1 U2.5(VREF)
NetU1_58: U2.27(~{RST}) ; port DW_RST
NetU1_59: U2.23(WAKEUP) ; port DW_WU

Not connected (* = marked no-connect by the designer): M2 6(NC); U2 29(SYNC/GPIO7) 34(GPIO4/EXTPA) 37(GPIO1/SFDLED) 38(GPIO0/RXOKLED)

### Layout directives
differential pair; rule Differential Pairs Routing [Pref Gap = 10mil    Min Gap  = 5mil    Max Gap  = 10milPref Width = 15mil    Min Width  = 8.474mil    Max Width  = 15mil]; rule Length Constraint [Min Length = 2mm    Max Length = 4mm]; rule Matched Net Lengths [Tolerance = 0.2mm]; rule Solder Mask Expansion [Expansion = 0.102mm]; rule Width Constraint [Pref Width = 10mil    Min Width = 10mil    Max Width = 10mil]: RF_N, RF_P
rule Width Constraint [Pref Impedance = 50,00ohms    Min Impedance = 50,00ohms    Max Impedance = 50,00ohms]; rule Routing Layers [TopLayer - Enabled BottomLayer - Disabled]; rule Parallel Segment Constraint [Gap = 0.5mm    Limit = 10mm    Layer - Same Layer]; rule Length Constraint [Min Length = 1mm    Max Length = 20mm]: NetA2_1
differential pair; rule Differential Pairs Routing [Pref Gap = 10mil    Min Gap  = 5mil    Max Gap  = 10milPref Width = 15mil    Min Width  = 8.474mil    Max Width  = 15mil]; rule Matched Net Lengths [Tolerance = 0.2mm]; rule Solder Mask Expansion [Expansion = 0.102mm]; rule Width Constraint [Pref Width = 10mil    Min Width = 10mil    Max Width = 10mil]: RF2_N, RF2_P

### Notes on the sheet
- Place all Decoupling caps as close to IC as possible
- (near C16) VDDPA1
- (near C17) VDDPA1
- (near C18) VDDPA1
- (near C19) VDDPA1
- (near C22) VDDPA2
- (near C23) VDDPA2
- (near C24) VDDPA2
- (near C25) VDDLNA
- (near C26) VBAT
- (near C27) VBAT
- (near C28) VDDAON
- (near C29) VDDIOA
- (near C39) PIN42
- (near C42) PIN31

### Library data of the parts
A2 = CMP-2000-05490-1: SMA End Launch Jack Receptacle, 50 Ohm, 0 to 18 GHz, -65 to 165 degC, 5-Pin SMD, RoHS, Bulk; Manufacturer: EmersonConnectivitySolutions; Connector Type: JackPCB; Gender: Jack(Female); Impedance: 50Ohms; Brand: Johnson/EmersonConnectivitySolutions; Body Material: Brass; Body Style: Straight; Maximum Frequency: 18GHz; Factory Pack Quantity: 5; Datasheet URL: https://belfuse.com/resources/Johnson/productinformation/pi-142-0701-801.pdf; Datasheet Version: 12/2014; Operating Temperature Range: -65Cto+165C; Mounting Technology: SurfaceMount; RF Series: SMA; Package Reference: 142-0701-801; Product Category: RFConnectors/CoaxialConnectors; Termination Style: Solder; RoHS: Details; Package URL: https://belfuse.com/resources/Johnson/drawings/dr-1420701801.pdf; Series: SMA; Package Description: 5-Pin Surface Mount Device, Body 14.275 x 9.525 mm; Manufacturer URL: http://www.cinch.com/; Contact Plating: Gold; Product: Connectors; Orientation: Straight
C16-C29 C31-C34 C36-C46 = CMP-2006-02891-1: as C1 on sheet STM32
C30 C35 = CMP-2008-03945-1: Manufacturer: Murata; Part Number: GRM1555C1H120GA01D
DS2 DS3 = CMP-0404-00001-1: as DS1 on sheet STM32_GPIO; Mounting Technology: Surface Mount; Storage Temperature: -40 to +85 degC; ComponentLink1URL: http://www.kingbright.com/; PackageDescription: 2-Pin SMT LED, 1.6 x 0.8 mm Pitch; PackageReference: 0603LED_GREEN; ComponentLink1Description: Manufacturer URL
FB2 FB3 = CMP-0686-00596-2: as FB1 on sheet STM32; ComponentLink2Description: Datasheet; ComponentLink1Description: Manufacturer URL; ComponentLink3Description: Package Specification; DatasheetVersion: 08/2013; Packing: Tape and Reel; PackageReference: BLM18_H650-2; PackageDescription: 2-Pin Chip, Body 1.6 x 0.8 mm; Mounting Technology: Surface Mount; Operating Temperature Range: -55 to 125 degC; ComponentLink1URL: http://www.murata.com/; ComponentLink2URL: http://www.murata.com/products/catalog/pdf/c31e.pdf; ComponentLink3URL: http://www.murata.com/products/catalog/pdf/c31e.pdf
M2 = CMP-2000-07459-1: Multilayer Balun, 3000 to 8000 MHz, -40 to 85 degC, 6-Pin SMD, RoHS, Tape and Reel; Manufacturer: TDK; Case\/Package: 0805; Impedance: 100Ohm; Insertion Loss: 1.5dB; Radiation Hardening: No; Number of Pins: 6; Manufacturer URL: http://www.tdk.com/; Min Operating Temperature: -40degC; Mounting Technology: SurfaceMount; RoHSCompliant: true; Package Description: 6-Pin Surface Mount Device, Body 2 x 1.25 mm, Pitch 0.65 mm; Datasheet URL: https://product.tdk.com/info/en/documents/data_sheet/rf_balun_hhm1595a1_en.pdf; Package Quantity: 1; Max Operating Temperature: 85degC; Packaging: TapeandReel; Package Reference: HHM1595A1; Termination: SMD/SMT; Datasheet Version: 04/2015; Case Code (Imperial): 0805; Case Code (Metric): 2012
R9 R10 R12-R20 = Res3: Resistor; Published: 8-Jun-2000; LatestRevisionDate: 29-May-2009; LatestRevisionNote: IPC-7351 Footprint Added.; PackageReference: J1-0603; Publisher: Altium Limited; PackageDescription: Chip Resistor
R11 = CMP-1747-00007-1: as R7 on sheet STM32_GPIO; RoHSCompliant: true; Case Code (Metric): 1608; Pins: 2; PackageDescription: 8-Pin Surface Mount Device, Body 1.6 x 3.2 mm, Pitch 0.8 mm; Height: 0.45 mm; Min Operating Temperature: -55 degC; ComponentLink1URL: http://www.bourns.com/; Case Code (Imperial): 0603; Packaging: Tape and Reel; PackageReference: CAY16-J4; ComponentLink1Description: Manufacturer URL; ComponentLink2Description: Datasheet; Length: 1.6 mm; Width: 0.8 mm; Max Operating Temperature: 155 degC; Mount: Surface Mount; DatasheetVersion: Sep-14; Voltage Rating: 50 V; REACH SVHC: No SVHC; ComponentLink2URL: http://www.bourns.com/pdfs/CATCAY.pdf; Package Quantity: 5000
U2 = DW1000-I: Ic Rf Txrx 802.15.4 48-Qfn; MF: Decawave Limited; Price: None; Package: QFN-48 Decawave; Availability: Unavailable; MP: DW1000-I; SnapEDA_Link: https://www.snapeda.com/parts/DW1000-I/Decawave%20Limited/view-part/?ref=snap; Value: *
Y3 = ECS-240-8-36-CKM-TR: The miniature ECX-2236 is a very compact SMD Crystal. The 2.5 x 2.0 x 0.55 mm ceramic package is ideal for today's SMD manufacturing environment.; MF: ECS Inc.; Price: None; SnapEDA_Link: https://www.snapeda.com/parts/ECS-240-8-36-CKM-TR/ECS%20Inc./view-part/?ref=snap; Package: SMD-4 ECS Inc.; Availability: Unavailable; MP: ECS-240-8-36-CKM-TR; Value: *

## Sheet PowerDomains.SchDoc
size A4
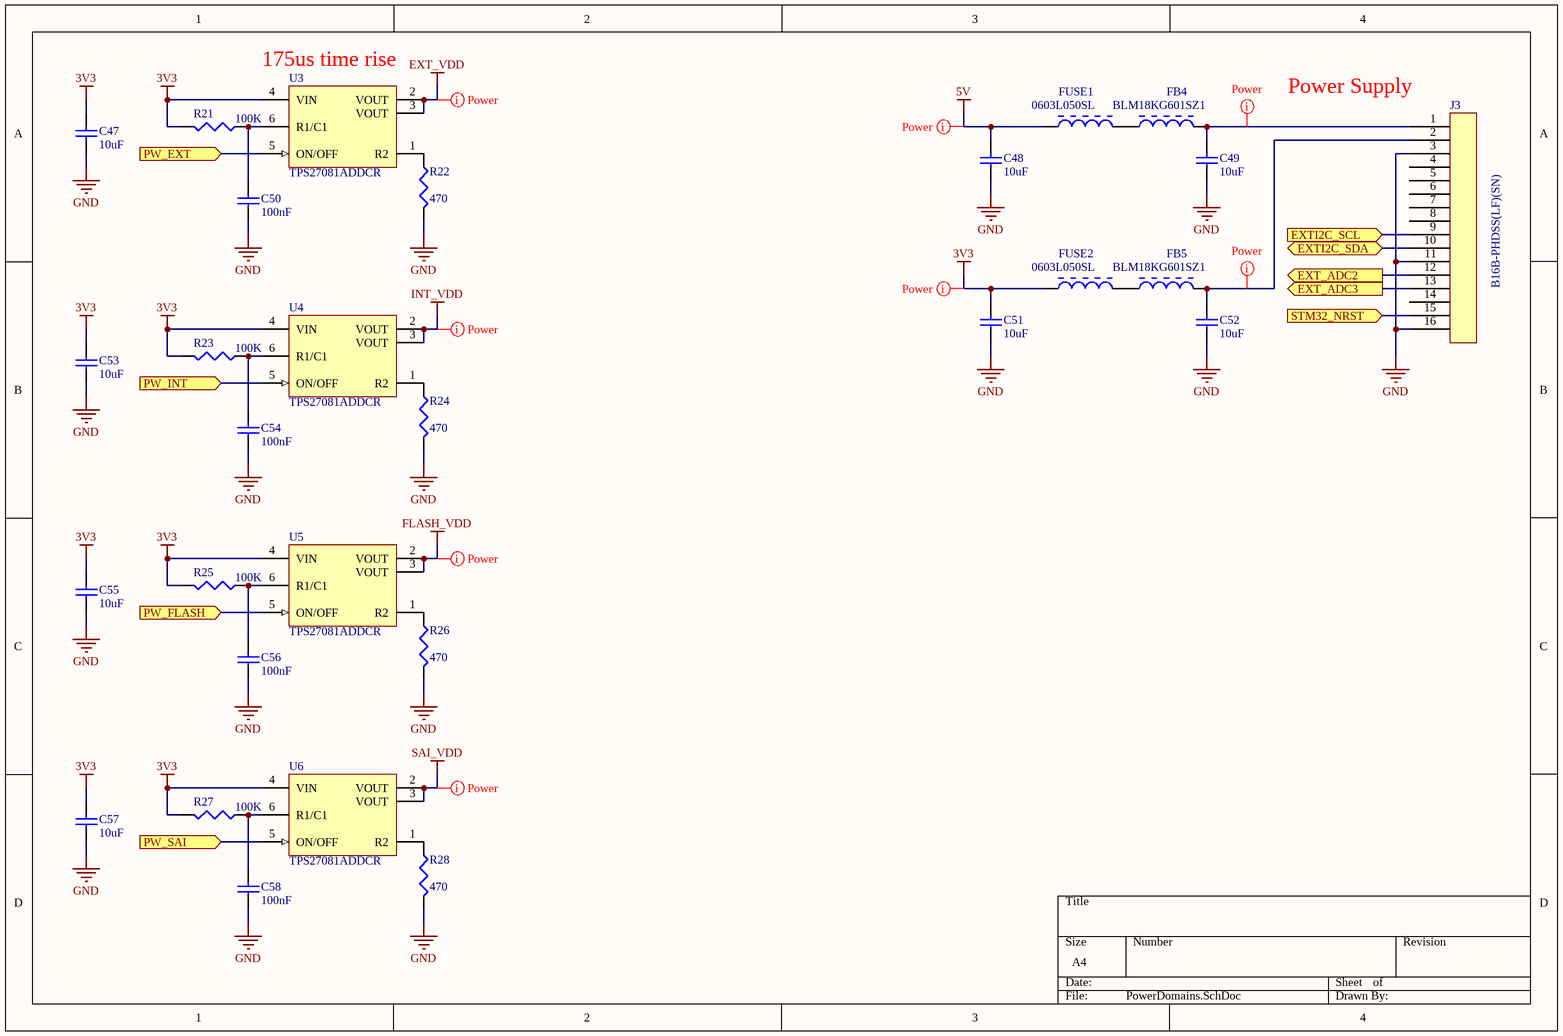
[diagram p6: PowerDomains.SchDoc]

### Parts
C47  10uF  [CAPC1608X90X35NL10T15]
C48  10uF  [CAPC1608X90X35NL10T15]
C49  10uF  [CAPC1608X90X35NL10T15]
C50  100nF  [CAPC1608X90X35NL10T15]
C51  10uF  [CAPC1608X90X35NL10T15]
C52  10uF  [CAPC1608X90X35NL10T15]
C53  10uF  [CAPC1608X90X35NL10T15]
C54  100nF  [CAPC1608X90X35NL10T15]
C55  10uF  [CAPC1608X90X35NL10T15]
C56  100nF  [CAPC1608X90X35NL10T15]
C57  10uF  [CAPC1608X90X35NL10T15]
C58  100nF  [CAPC1608X90X35NL10T15]
FB4  BLM18KG601SZ1  [MURA-BLM18SG-B25-CHIP-2_V1]
FB5  BLM18KG601SZ1  [MURA-BLM18SG-B25-CHIP-2_V1]
FUSE1  0603L050SL  [MURA-BLM18SG-B25-CHIP-2_V1]
FUSE2  0603L050SL  [MURA-BLM18SG-B25-CHIP-2_V1]
J3  B16B-PHDSS(LF)(SN)  [B16B-PHDSS(LF)(SN) - duplicate]
R21  value 100K  [J1-0603]
R22  value 470  [J1-0603]
R23  value 100K  [J1-0603]
R24  value 470  [J1-0603]
R25  value 100K  [J1-0603]
R26  value 470  [J1-0603]
R27  value 100K  [J1-0603]
R28  value 470  [J1-0603]
U3  TPS27081ADDCR  [DDC0006A_L]
U4  TPS27081ADDCR  [DDC0006A_L]
U5  TPS27081ADDCR  [DDC0006A_L]
U6  TPS27081ADDCR  [DDC0006A_L]

### Ports
EXT_ADC2 (out), EXT_ADC3 (out), EXTI2C_SCL (in), EXTI2C_SDA (bidir), PW_EXT (in), PW_FLASH (in), PW_INT (in), PW_SAI (in), STM32_NRST (in)

### Nets
3V3: C47.2 C51.2 C53.2 C55.2 C57.2 FUSE2.1 R21.2 R23.2 R25.2 R27.2 U3.4(VIN) U4.4(VIN) U5.4(VIN) U6.4(VIN)
5V: C48.2 FUSE1.1
EXT_VDD: U3.2(VOUT) U3.3(VOUT)
FLASH_VDD: U5.2(VOUT) U5.3(VOUT)
GND: C47.1 C48.1 C49.1 C50.1 C51.1 C52.1 C53.1 C54.1 C55.1 C56.1 C57.1 C58.1 J3.3 J3.11 J3.16 R22.2 R24.2 R26.2 R28.2
INT_VDD: U4.2(VOUT) U4.3(VOUT)
SAI_VDD: U6.2(VOUT) U6.3(VOUT)
NetC1_2: J3.15 ; port STM32_NRST
NetC49_2: C49.2 FB4.2 J3.1
NetC50_2: C50.2 R21.1 U3.6(R1/C1)
NetC52_2: C52.2 FB5.2 J3.2
NetC54_2: C54.2 R23.1 U4.6(R1/C1)
NetC56_2: C56.2 R25.1 U5.6(R1/C1)
NetC58_2: C58.2 R27.1 U6.6(R1/C1)
NetFB4_1: FB4.1 FUSE1.2
NetFB5_1: FB5.1 FUSE2.2
NetJ1_9: J3.9 ; port EXTI2C_SCL
NetJ1_10: J3.10 ; port EXTI2C_SDA
NetJ3_12: J3.12 ; port EXT_ADC2
NetJ3_13: J3.13 ; port EXT_ADC3
NetR22_1: R22.1 U3.1(R2)
NetR24_1: R24.1 U4.1(R2)
NetR26_1: R26.1 U5.1(R2)
NetR28_1: R28.1 U6.1(R2)
NetU1_24: U5.5(ON/OFF) ; port PW_FLASH
NetU1_61: U3.5(ON/OFF) ; port PW_EXT
NetU1_62: U4.5(ON/OFF) ; port PW_INT
NetU1_65: U6.5(ON/OFF) ; port PW_SAI

Not connected (* = marked no-connect by the designer): J3 4 5 6 7 8 14

### Layout directives
rule Width Constraint [Pref Width = 0.4mm    Min Width = 0.3mm    Max Width = 0.6mm]; rule Routing Via Style [Pref Size = 0.5mm    Pref Hole Size = 0.3mm]: 3V3, 5V, EXT_VDD, FLASH_VDD, INT_VDD, NetC49_2, NetC52_2, SAI_VDD

### Notes on the sheet
- (near U3) 175us time rise
- (near J3) Power Supply

### Library data of the parts
C47-C58 = CMP-2006-02891-1: as C1 on sheet STM32
FB4 FB5 FUSE1 FUSE2 = CMP-0686-00596-2: as FB1 on sheet STM32; ComponentLink2Description: Datasheet; ComponentLink1Description: Manufacturer URL; ComponentLink3Description: Package Specification; DatasheetVersion: 08/2013; Packing: Tape and Reel; PackageReference: BLM18_H650-2; PackageDescription: 2-Pin Chip, Body 1.6 x 0.8 mm; Mounting Technology: Surface Mount; Operating Temperature Range: -55 to 125 degC; ComponentLink1URL: http://www.murata.com/; ComponentLink2URL: http://www.murata.com/products/catalog/pdf/c31e.pdf; ComponentLink3URL: http://www.murata.com/products/catalog/pdf/c31e.pdf
R21-R28 = Res3: Resistor; Published: 8-Jun-2000; LatestRevisionDate: 29-May-2009; LatestRevisionNote: IPC-7351 Footprint Added.; PackageReference: J1-0603; Publisher: Altium Limited; PackageDescription: Chip Resistor
U3-U6 = CMP-2000-07278-1: PFET High-Side Load Switch with Level Shift and Adjustable Slew Rate Control, 1 to 8 V, 3 A, -40 to 85 degC, 6-Pin SOT (DDC), Green (RoHS & no Sb/Br), Tape and Reel; Manufacturer Product Page: TPS27081ADDCRSpecifications; Manufacturer: Texas Instruments; VIN Max: 8V; Power Dissipation Max: 1190mW; Interface: On/Off; Voltage - Load: 1.2V~8V; Rds On (Typ): 32mOhm; Voltage - Supply (Vcc/Vdd): NotRequired; EDA / CAD Models: DownloadfromAcceleratedDesigns; Ratio - Input: Output:1:1; Online Catalog: GeneralPurpose; VIN Min: 1V; Number of Outputs: 1; Output Configuration: HighSide; Package Version: 4204403-3/E, 06/2005; Current - Output (Max): 3A; Other Names: 296-34970-6; Manufacturer URL: http://www.ti.com/; Category: IntegratedCircuits(ICs); Standard Package: 1; Features: SlewRateControlled; Operating Temperature: -40°C~85°C(TA); Datasheet Version: Rev. E, 06/2015; PartNumber: TPS27081A; Package Reference: DDC6; Mounting Technology: SurfaceMount; Package URL: http://www.ti.com/litv/pdf/mpds124d; Package / Case: SOT-23-6Thin,TSOT-23-6; Family: PMIC-PowerDistributionSwitches,LoadDrivers; Supplier Device Package: 6-SOT; Datasheet URL: http://www.ti.com/lit/ds/symlink/tps27081a.pdf; Packaging: Digi-Reel®; Switch Type: GeneralPurpose; Package Description: 6-Pin Small Outline Transistor, Body 2.9 x 1.6 mm, Pitch 0.95 mm

## Nets that join several sheets
3V3: STM32 (R1.1), STM32_GPIO (J1.2 J2.1), DW1000 (R9.1), PowerDomains (14 pins)
5V: STM32_GPIO (J1.1), PowerDomains (C48.2 FUSE1.1)
EXT_VDD: STM32_GPIO (J1.14 J1.15 R4.2 R5.2), PowerDomains (U3.2 U3.3)
FLASH_VDD: ExtFlash (C59.2 F1.8 R29.2 R49.2), PowerDomains (U5.2 U5.3)
GND: STM32 (25 pins), STM32_GPIO (8 pins), ExtFlash (C59.1 F1.4 F1.9), TmpLightHumBaro (31 pins), MotionMicrophone (19 pins), DW1000 (43 pins), PowerDomains (19 pins)
INT_VDD: TmpLightHumBaro (28 pins), PowerDomains (U4.2 U4.3)
SAI_VDD: MotionMicrophone (8 pins), PowerDomains (U6.2 U6.3)
NetC1_2: STM32 (C1.2 R2.1 R3.1 U1.8), PowerDomains (J3.15)
NetC12_2: STM32 (C12.2 Y2.1), STM32_GPIO (U1.3)
NetC13_2: STM32 (C13.2 Y2.2), STM32_GPIO (U1.4)
NetJ1_9: STM32_GPIO (J1.9 R4.1 U1.28), PowerDomains (J3.9)
NetJ1_10: STM32_GPIO (J1.10 R5.1 U1.29), PowerDomains (J3.10)
NetJ2_10: STM32 (R2.2), STM32_GPIO (J2.10 U1.64)
NetJ3_12: STM32_GPIO (U1.15), PowerDomains (J3.12)
NetJ3_13: STM32_GPIO (U1.16), PowerDomains (J3.13)
NetR11_5: STM32_GPIO (U1.46), DW1000 (R11.5)
NetR11_6: STM32_GPIO (U1.49), DW1000 (R11.6)
NetR11_7: STM32_GPIO (U1.48), DW1000 (R11.7)
NetR11_8: STM32_GPIO (U1.47), DW1000 (R11.8)
NetR16_2: STM32_GPIO (U1.38), DW1000 (R16.2 U2.45)
NetR30_1: STM32_GPIO (U1.17), ExtFlash (R30.1)
NetR30_2: STM32_GPIO (U1.6), ExtFlash (R30.2)
NetR30_3: STM32_GPIO (U1.22), ExtFlash (R30.3)
NetR31_5: STM32_GPIO (U1.7), ExtFlash (R31.5)
NetR31_6: STM32_GPIO (U1.18), ExtFlash (R31.6)
NetR31_7: STM32_GPIO (U1.21), ExtFlash (R31.7)
NetR38_2: STM32_GPIO (U1.2), MotionMicrophone (R38.2 U7.7)
NetR42_1: STM32_GPIO (U1.39), TmpLightHumBaro (R42.1 S5.3)
NetR43_2: STM32_GPIO (U1.12), TmpLightHumBaro (R43.2 S4.4)
NetR44_2: STM32_GPIO (U1.25), TmpLightHumBaro (R44.2 S7.7)
NetR45_2: STM32_GPIO (U1.26), TmpLightHumBaro (R45.2 S8.9)
NetR46_1: STM32_GPIO (U1.67), TmpLightHumBaro (7 pins)
NetR47_1: STM32_GPIO (U1.66), TmpLightHumBaro (7 pins)
NetR48_2: STM32_GPIO (U1.27), TmpLightHumBaro (R48.2 S8.4)
NetS2_2: STM32_GPIO (U1.51), MotionMicrophone (S2.2)
NetS2_3: STM32_GPIO (U1.23), MotionMicrophone (S2.3)
NetU1_24: STM32_GPIO (U1.24), PowerDomains (U5.5)
NetU1_58: STM32_GPIO (U1.58), DW1000 (U2.27)
NetU1_59: STM32_GPIO (U1.59), DW1000 (U2.23)
NetU1_61: STM32_GPIO (U1.61), PowerDomains (U3.5)
NetU1_62: STM32_GPIO (U1.62), PowerDomains (U4.5)
NetU1_65: STM32_GPIO (U1.65), PowerDomains (U6.5)